# Altium schematic sheet Power.SchDoc
size A4
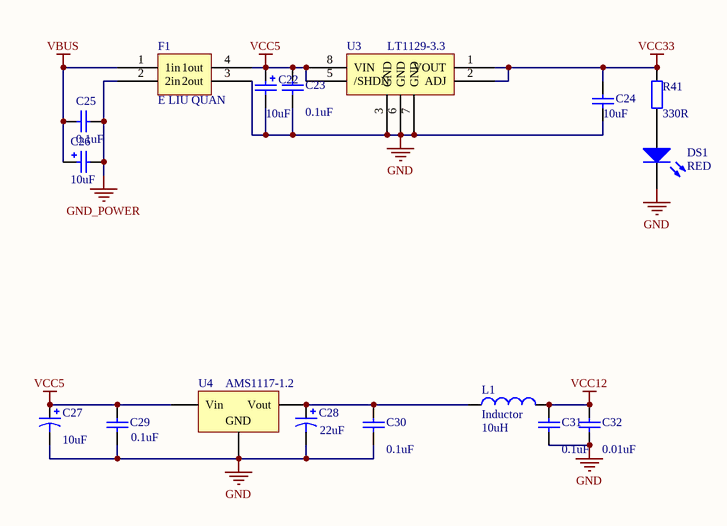
[diagram p0: Power.SchDoc]

## Parts
C22  value 10uF  [cc0603]
C23  value 0.1uF  [cc0603]
C24  value 10uF  [cc0603]
C25  value 0.1uF  [cc0603]
C26  value 10uF  [CC6332-2512]
C27  value 10uF  [CC6332-2512]
C28  value 22uF  [CC6332-2512]  (hidden comment: Cap Pol1)
C29  value 0.1uF  [cc0603]
C30  value 0.1uF  [cc0603]
C31  value 0.1uF  [cc0603]
C32  value 0.01uF  [cc0603]
DS1  RED  [CR0805]
F1  E LIU QUAN  [L_eliuquan]
L1  Inductor  value 10uH  [CR0603]
R41  value 330R  [CR0603]  (hidden comment: Res2)
U3  LT1129-3.3  [sop8]
U4  Volt Reg  [AS1117]  (value not drawn)

## Nets
GND: C22.2 C23.1 C24.1 C27.2 C28.2 C29.1 C30.1 C31.1 C32.1 DS1.2(K) F1.3(2out) U3.3(GND) U3.6(GND) U3.7(GND) U4.1(GND)
GND_POWER: C25.1 C26.2 F1.2(2in)
VBUS: C25.2 C26.1 F1.1(1in)
VCC5: C22.1 C23.2 C27.1 C29.2 F1.4(1out) U3.5(/SHDN) U3.8(VIN) U4.3(Vin)
VCC12: C31.2 C32.2 L1.2
VCC33: C24.2 R41.2 U3.1(VOUT) U3.2(ADJ)
NetC28_1: C28.1 C30.2 L1.1 U4.2(Vout)
NetDS1_1: DS1.1(A) R41.1

## Notes on the sheet
- (near U4) AMS1117-1.2

## Library data of the parts
C22 C26-C28 = Cap Pol1: Polarized Capacitor (Radial); Published: 8-Jun-2000; Publisher: Altium Limited
  C22 C26: Revision: July-2002: Re-released for DXP Platform.
  C27: LatestRevisionDate: 17-Jul-2002; LatestRevisionNote: Re-released for DXP Platform.; PackageReference: RB7.6-15
  C28: LatestRevisionDate: 17-Jul-2002; LatestRevisionNote: Re-released for DXP Platform.
C23-C25 C29-C32 = Cap: Capacitor; Published: 8-Jun-2000; Publisher: Altium Limited
  C23-C25: Revision: July-2002: Re-released for DXP Platform.
  C29-C32: LatestRevisionDate: 17-Jul-2002; LatestRevisionNote: Re-released for DXP Platform.; PackageReference: RAD-0.3
DS1 = LED0: Typical INFRARED GaAs LED; Published: 8-Jun-2000; LatestRevisionDate: 17-Jul-2002; LatestRevisionNote: Re-released for DXP Platform.; Publisher: Altium Limited
L1 = Inductor: Code_IEC: 1005; Published: 8-Jun-2000; LatestRevisionDate: 17-Jul-2002; LatestRevisionNote: Re-released for DXP Platform.; PackageReference: 0402-A; Publisher: Altium Limited; Code_JEITA: 0402
R41 = Res2: Resistor; Published: 8-Jun-2000; LatestRevisionDate: 17-Jul-2002; LatestRevisionNote: Re-released for DXP Platform.; Publisher: Altium Limited
U4 = Volt Reg: Voltage Regulator; Published: 24-Mar-1999; LatestRevisionDate: 17-Jul-2002; LatestRevisionNote: Re-released for DXP Platform.; Publisher: Altium Limited; Code_JEDEC: SMD-220